# EAGLE schematic Electronics Schematic (EAGLE 9.7.0)
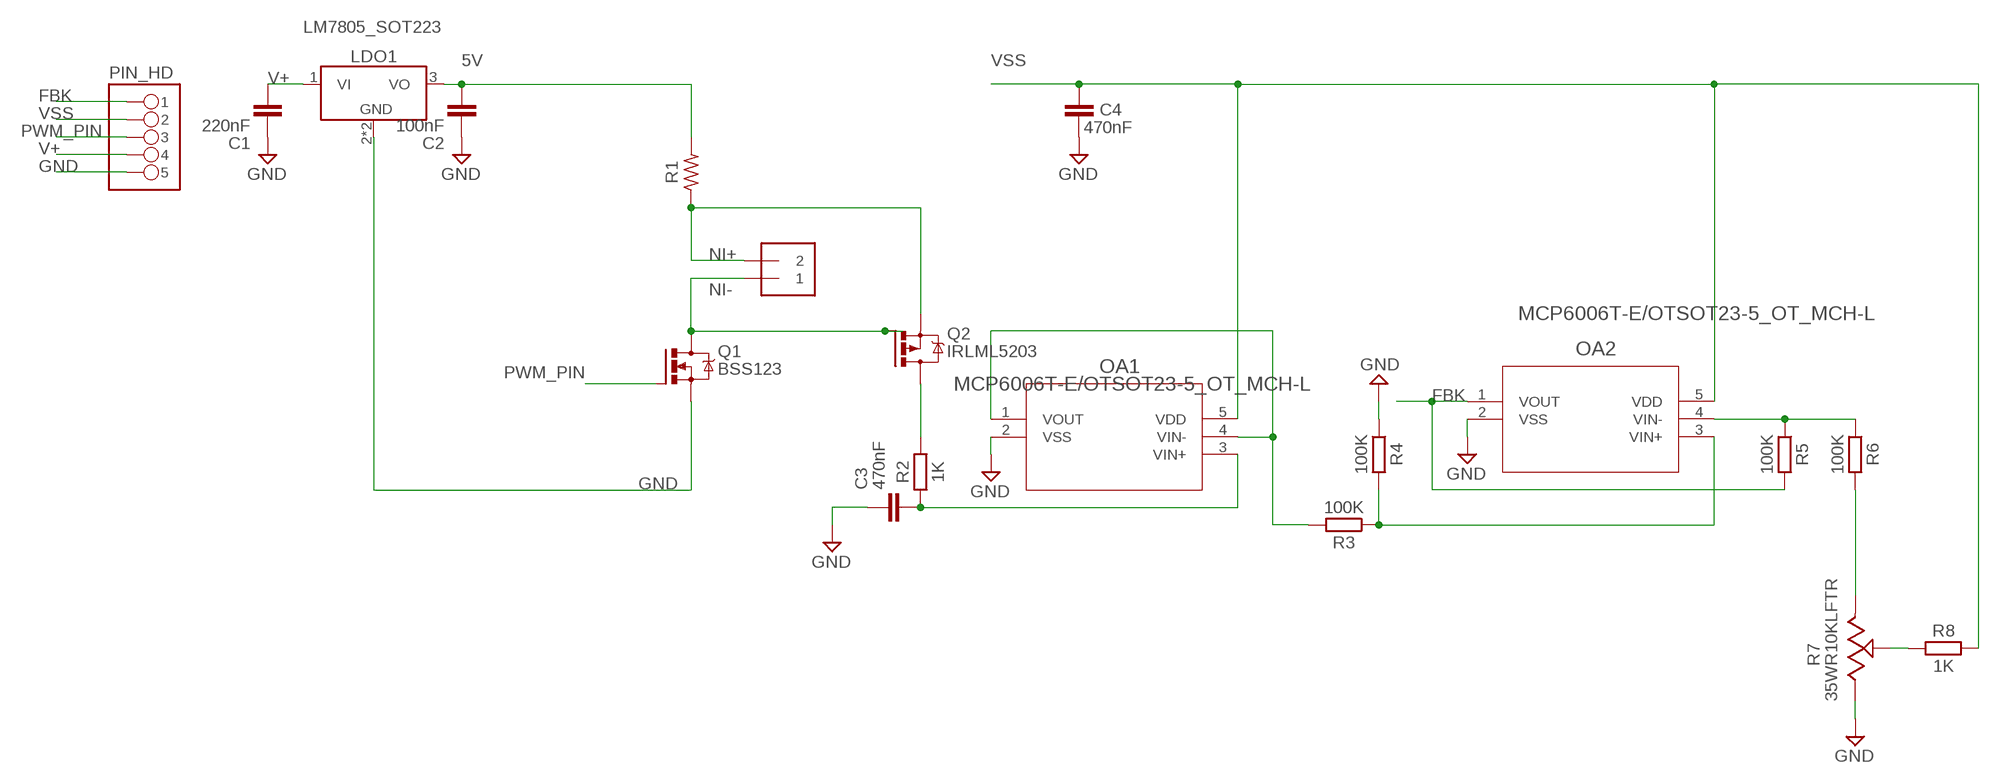
[diagram p0: schematic, sheet 1]

## Parts
C1  220nF  C_CHIP-0402(1005-METRIC)  [CAPC1005X60]
C2  100nF  C_CHIP-0402(1005-METRIC)  [CAPC1005X60]
C3  470nF  C_CHIP-0402(1005-METRIC)  [CAPC1005X60]
C4  470nF  C_CHIP-0402(1005-METRIC)  [CAPC1005X60]
LDO1  LM7805_SOT223  [SOT230P700X170-4]
NITI  1X2-3.5MM  [1X2-3.5MM]
OA1  MCP6006T-E/OTSOT23-5_OT_MCH-L  [SOT23-5_OT_MCH-L]
OA2  MCP6006T-E/OTSOT23-5_OT_MCH-L  [SOT23-5_OT_MCH-L]
PIN_HD  PINHD-1X05_1X05M  [1X05]
Q1  BSS123  NMOSFET_BSS123_SOT23-GSD  [SOT23]
Q2  IRLML5203  PMOSFET_IRLML5203_SOT23-GSD  [SOT23]
R1  R-US_AXIAL-11.7MM-PITCH  [RESAD1176W63L850D250B]
R2  1K  R_CHIP-0402(1005-METRIC)  [RESC1005X40]
R3  100K  R_CHIP-0402(1005-METRIC)  [RESC1005X40]
R4  100K  R_CHIP-0402(1005-METRIC)  [RESC1005X40]
R5  100K  R_CHIP-0402(1005-METRIC)  [RESC1005X40]
R6  100K  R_CHIP-0402(1005-METRIC)  [RESC1005X40]
R7  35WR10KLFTR  [TRIM_35WR10KLFTR]
R8  1K  R_CHIP-0402(1005-METRIC)  [RESC1005X40]

## Nets
5V: C2.2 LDO1.3(VO) R1.2
FBK: OA2.1(VOUT) PIN_HD.1 R5.2
GND: C1.1 C2.1 C3.1 C4.1 LDO1.2(GND) LDO1.4(GND) OA1.2(VSS) OA2.2(VSS) PIN_HD.5 Q1.2(S) R4.1 R7.1
N$1: Q2.3(D) R2.2
N$2: R7.2 R8.1
N$3: OA2.4(VIN-) R5.1 R6.1
N$4: OA2.3(VIN+) R3.1 R4.2
N$6: R6.2 R7.3
N$7: OA1.1(VOUT) OA1.4(VIN-) R3.2
NI+: NITI.2 Q2.2(S) R1.1
NI-: NITI.1 Q1.3(D) Q2.1(G)
PWM_PIN: PIN_HD.3 Q1.1(G)
R2_TEST: C3.2 OA1.3(VIN+) R2.1
V+: C1.2 LDO1.1(VI) PIN_HD.4
VSS: C4.2 OA1.5(VDD) OA2.5(VDD) PIN_HD.2 R8.2

## Library data of the parts
C1-C4 = Capacitor:C: Capacitor - Generic; CATEGORY: Capacitor
LDO1 = Tinkercad:LM7805: 5V Voltage Regulator Reference Datasheet <https://www.ti.com/lit/ds/symlink/lm340.pdf>
NITI = adafruit:1X2: 3.5mm Terminal block http://www.ladyada.net/library/pcb/eaglelibrary.html
OA1 OA2 = MCP6006T_E_OT:MCP6006T-E/OT; COPYRIGHT: Copyright (C) 2024 Ultra Librarian. All rights reserved.; MANUFACTURER_PART_NUMBER: MCP6006T-E/OT; MFR_NAME: Microchip
PIN_HD = Tinkercad:PINHD-1X05
Q1 = Transistor:NMOSFET_: N-Channel MOSFET - Popular parts; CATEGORY: Transistor; DESCRIPTION: MOSFET N-CH 100V 0.17A SOT-23; DRAIN_CURRENT: 170mA; MANUFACTURER: ON Semiconductor; MPN: BSS123L; OPERATING_TEMP: -55°C ~ 150°C; PART_STATUS: Active; ROHS_COMPLIANT: Yes; SUB-CATEGORY: MOSFET; THERMALLOSS: 360mW; TYPE: N-Channel
Q2 = Transistor:PMOSFET_: P-Channel MOSFET - Popular parts; CATEGORY: Transistor; DESCRIPTION: MOSFET P-CH 30V 3A SOT-23; DRAIN_CURRENT: 3A; MANUFACTURER: Infineon Technologies; MPN: IRLML5203TRPBF; OPERATING_TEMP: -55°C ~ 150°C; PART_STATUS: Active; ROHS_COMPLIANT: Yes; SUB-CATEGORY: MOSFET; THERMALLOSS: 1.25W; TYPE: P-Channel
R1 = Resistor:R-US: Resistor Fixed - ANSI; CATEGORY: Resistor; SUB-CATEGORY: Fixed
R2-R6 R8 = Resistor:R: Resistor Fixed - Generic; CATEGORY: Resistor; SUB-CATEGORY: Fixed
R7 = 35WR10KLFTR:35WR10KLFTR; MANUFACTURER: TT Electronics/BI; MAXIMUM_PACKAGE_HEIGHT: 1.8mm; PARTREV: D; STANDARD: Manufacturer Recommendations